# Altium schematic sheet Clocks.SchDoc: xcore.ai Multi Channel Audio
size 408 x 287 mm; DocumentNumber: 6; Revision: 1V1; SheetNumber: 6; SheetTotal: 8
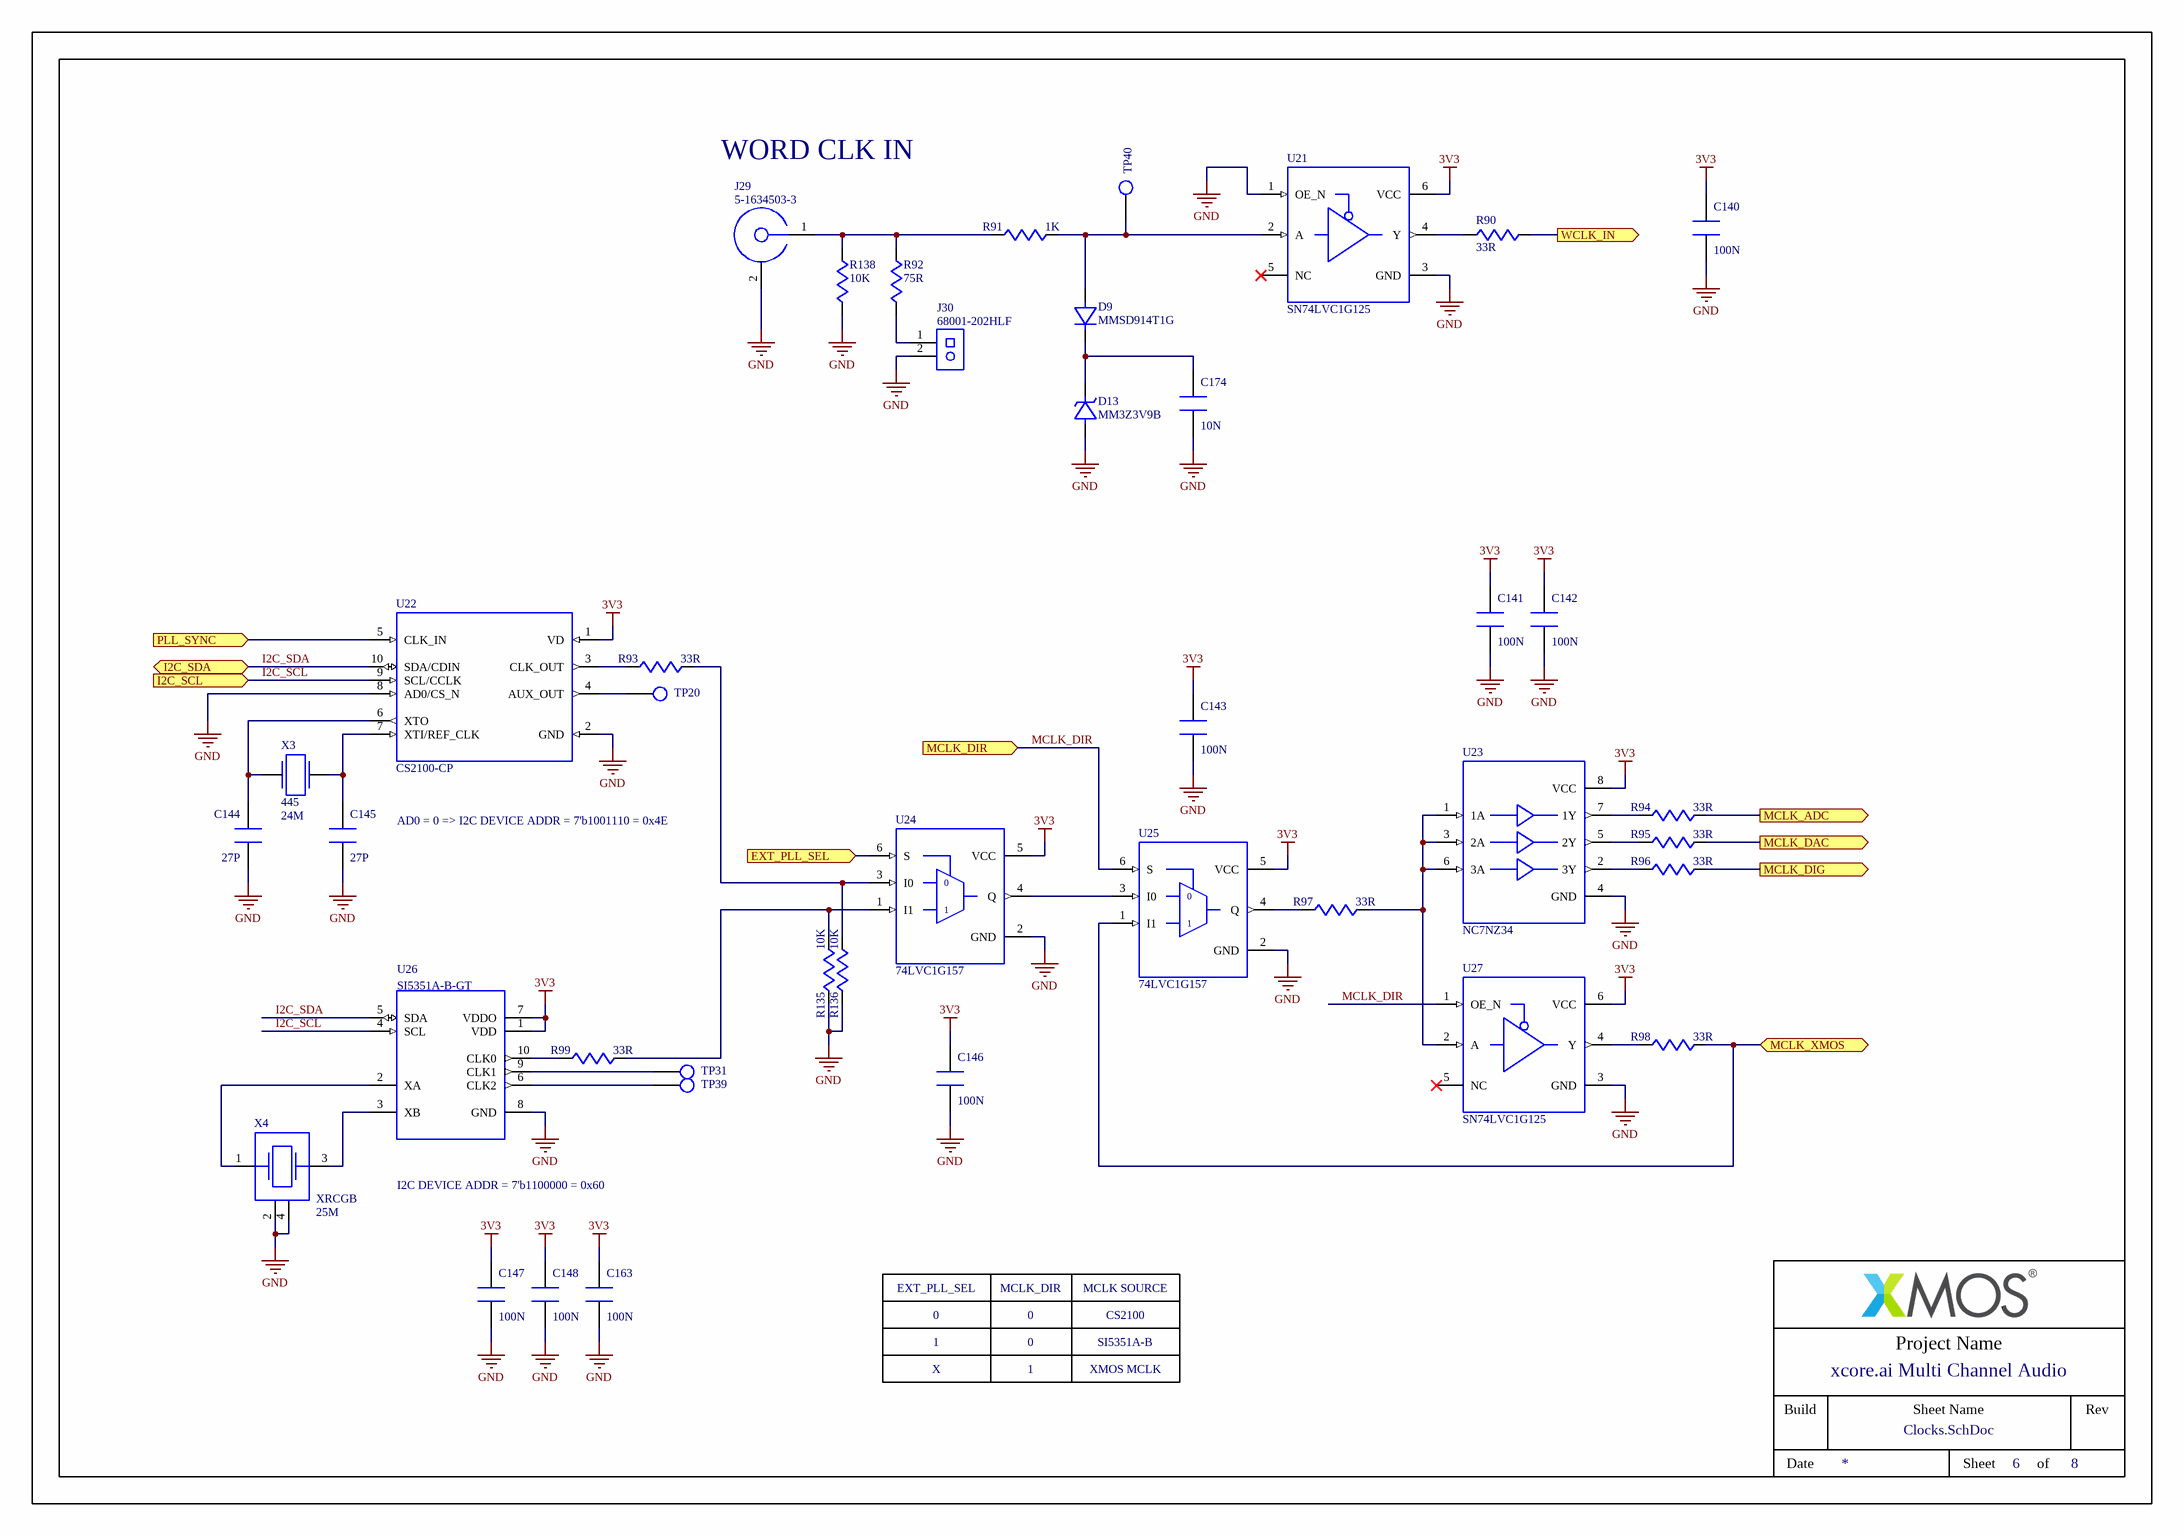
[diagram p0: Clocks.SchDoc]

## Parts
C140  100N  [CAPC1005X55N]
C141  100N  [CAPC1005X55N]
C142  100N  [CAPC1005X55N]
C143  100N  [CAPC1005X55N]
C144  27P  [CAPC1005X55N]
C145  27P  [CAPC1005X55N]
C146  100N  [CAPC1005X55N]
C147  100N  [CAPC1005X55N]
C148  100N  [CAPC1005X55N]
C163  100N  [CAPC1005X55N]
C174  10N  [CAPC1005X55N]
D9  MMSD914T1G  [SOD3716X135N]
D13  MM3Z3V9B  [SODFL2513X100N]
J29  5-1634503-3  [CON_TE_5_1634503]
J30  68001-202HLF  [HDR_FCI_68001_202]
R90  33R  [RESC1608X55N]
R91  1K  [RESC1608X55N]
R92  75R  [RESC3116X65N]
R93  33R  [RESC1608X55N]
R94  33R  [RESC1608X55N]
R95  33R  [RESC1608X55N]
R96  33R  [RESC1608X55N]
R97  33R  [RESC1608X55N]
R98  33R  [RESC1608X55N]
R99  33R  [RESC1608X55N]
R135  10K  [RESC1608X55N]
R136  10K  [RESC1608X55N]
R138  10K  [RESC1608X55N]
TP20  TESTPOINT  [TESTPOINT_THRU]  (value not drawn)  (no BOM)
TP31  TESTPOINT  [TESTPOINT_THRU]  (value not drawn)  (no BOM)
TP39  TESTPOINT  [TESTPOINT_THRU]  (value not drawn)  (no BOM)
TP40  TESTPOINT  [TESTPOINT_SMD_1MM]  (value not drawn)  (no BOM)
U21  SN74LVC1G125  [TI_R_PUSON_N6]
U22  CS2100-CP  [SOP50P490X110-10N]
U23  NC7NZ34  [SOP50P310X100-8N]
U24  74LVC1G157  [SOT95P280X145-6N]
U25  74LVC1G157  [SOT95P280X145-6N]
U26  SI5351A-B-GT  [SOP50P490X110-10N]
U27  SN74LVC1G125  [TI_R_PUSON_N6]
X3  445  FREQUENCY: 24M  [XTAL_CTS_445]
X4  XRCGB  FREQUENCY: 25M  [OSCCC200X160X70N]

## Ports
EXT_PLL_SEL (in), I2C_SCL (in), I2C_SDA (bidir), MCLK_ADC (out), MCLK_DAC (out), MCLK_DIG (out), MCLK_DIR (in), MCLK_XMOS (bidir), PLL_SYNC (in), WCLK_IN (out)

## Nets
3V3: C140.1 C141.1 C142.1 C143.1 C146.1 C147.1 C148.1 C163.1 U21.6(VCC) U22.1(VD) U23.8(VCC) U24.5(VCC) U25.5(VCC) U26.1(VDD) U26.7(VDDO) U27.6(VCC)
GND: C140.2 C141.2 C142.2 C143.2 C144.2 C145.2 C146.2 C147.2 C148.2 C163.2 C174.2 D13.2(A) J29.2 J30.2 R135.1 R136.1 R138.1 U21.1(OE_N) U21.3(GND) U22.2(GND) U22.8(AD0/CS_N) U23.4(GND) U24.2(GND) U25.2(GND) U26.8(GND) U27.3(GND) X4.2(CASE_2) X4.4(CASE_4)
EXT_PLL_SEL: U24.6(S) ; port EXT_PLL_SEL
I2C_SCL: U22.9(SCL/CCLK) U26.4(SCL) ; port I2C_SCL
I2C_SDA: U22.10(SDA/CDIN) U26.5(SDA) ; port I2C_SDA
MCLK_ADC: R94.2 ; port MCLK_ADC
MCLK_DAC: R95.2 ; port MCLK_DAC
MCLK_DIG: R96.2 ; port MCLK_DIG
MCLK_DIR: U25.6(S) U27.1(OE_N) ; port MCLK_DIR
MCLK_XMOS: R98.2 U25.1(I1) ; port MCLK_XMOS
PLL_SYNC: U22.5(CLK_IN) ; port PLL_SYNC
WCLK_IN: R90.2 ; port WCLK_IN
NetC144_1: C144.1 U22.6(XTO) X3.1(A)
NetC145_1: C145.1 U22.7(XTI/REF_CLK) X3.2(B)
NetC174_1: C174.1 D9.1(K) D13.1(K)
NetD9_2: D9.2(A) R91.2 TP40.1 U21.2(A)
NetJ29_1: J29.1 R91.1 R92.2 R138.2
NetJ30_1: J30.1 R92.1
NetR90_1: R90.1 U21.4(Y)
NetR93_1: R93.1 U22.3(CLK_OUT)
NetR93_2: R93.2 R136.2 U24.3(I0)
NetR94_1: R94.1 U23.7(1Y)
NetR95_1: R95.1 U23.5(2Y)
NetR96_1: R96.1 U23.2(3Y)
NetR97_1: R97.1 U25.4(Q)
NetR97_2: R97.2 U23.1(1A) U23.3(2A) U23.6(3A) U27.2(A)
NetR98_1: R98.1 U27.4(Y)
NetR99_1: R99.1 U26.10(CLK0)
NetR99_2: R99.2 R135.2 U24.1(I1)
NetTP20_1: TP20.1 U22.4(AUX_OUT)
NetTP31_1: TP31.1 U26.9(CLK1)
NetTP39_1: TP39.1 U26.6(CLK2)
NetU24_4: U24.4(Q) U25.3(I0)
NetU26_2: U26.2(XA) X4.1(A)
NetU26_3: U26.3(XB) X4.3(B)

Not connected (* = marked no-connect by the designer): U21 5(NC)*; U27 5(NC)*

## Notes on the sheet
- WORD CLK IN
- AD0 = 0 => I2C DEVICE ADDR = 7'b1001110 = 0x4E
- I2C DEVICE ADDR = 7'b1100000 = 0x60
- EXT_PLL_SEL
- MCLK_DIR
- MCLK SOURCE
- 0
- 1
- SI5351A-B
- CS2100
- X
- XMOS MCLK
- Project Name
- Build
- Sheet Name
- Rev
- Date
- Sheet
- of
- (in symbol GEN-11-0050) 0

## Library data of the parts
C140-C143 C146-C148 C163 = STD-06-0048: CHIP CAPACITOR, CERAMIC, 100NF, 16V, 10%, X7R, 0402; Manufacturer: Yageo; Manufacturer Part Number: CC0402KRX7R7BB104; Approx Volume Cost ($): 0.003; VALUE: 100N; Part Number: STD-06-0048; Dielectric: X7R; Rated Voltage: 16V; Tolerance: 10%; Web Search Link: http://www.google.com/search?q=CC0402KRX7R7BB104
C144 C145 = STD-06-0018: CHIP CAPACITOR, CERAMIC, 27PF, 50V, 5%, NP0, 0402; Manufacturer: Yageo; Manufacturer Part Number: CC0402JRNPO9BN270; Approx Volume Cost ($): 0.003; VALUE: 27P; Part Number: STD-06-0018; Dielectric: NP0; Rated Voltage: 50V; Tolerance: 5%; Web Search Link: http://www.google.com/search?q=CC0402JRNPO9BN270
C174 = STD-06-0042: CHIP CAPACITOR, CERAMIC, 10NF, 50V, 10%, X7R, 0402; Manufacturer: Yageo; Manufacturer Part Number: CC0402KRX7R9BB103; Approx Volume Cost ($): 0.002; VALUE: 10N; Part Number: STD-06-0042; Dielectric: X7R; Rated Voltage: 50V; Tolerance: 10%; Web Search Link: http://www.google.com/search?q=CC0402KRX7R9BB103
D9 = GEN-16-0055: Diode, 100V, 0.2A, SOD123; Manufacturer: ON Semiconductor; Approx Volume Cost ($): 0.04; VALUE: MMSD914T1G; Part Number: GEN-16-0055; Manufacturer Part Number: MMSD914T1G; Web Search Link: http://www.google.com/search?q=MMSD914T1G
D13 = GEN-16-0053: Zener Diode, 3.9V, 2%, 0.2W, SOD-323F; Manufacturer: ON Semiconductor; Approx Volume Cost ($): 0.03; VALUE: MM3Z3V9B; Part Number: GEN-16-0053; Manufacturer Part Number: MM3Z3V9B; Web Search Link: http://www.google.com/search?q=MM3Z3V9B
J29 = GEN-01-0127: BNC Jack, Board Mount, Vertical, 75 ohm, w/Mounting Posts; Manufacturer: TE Connectivity; Approx Volume Cost ($): 1.4; VALUE: 5-1634503-3; Part Number: GEN-01-0127; Manufacturer Part Number: 5-1634503-3; Web Search Link: http://www.google.com/search?q=5-1634503-3
J30 = GEN-01-0011: Pin Header, Male, Vertical, Through Hole, 2 Way, 1x2, 0.1 Inch Pitch; Manufacturer: FCI; Approx Volume Cost ($): 0.08; VALUE: 68001-202HLF; Part Number: GEN-01-0011; Manufacturer Part Number: 68001-202HLF; Web Search Link: http://www.google.com/search?q=68001-202HLF
R90 R93-R99 = STD-02-0026: CHIP RESISTOR, 33 OHM, 0.1W, 1%, 0603; Manufacturer: Yageo; Manufacturer Part Number: RC0603FR-0733RL; Max Voltage: 50V; Max Power: 100mW; Temperature Coefficient: ±100ppm/°C; Approx Volume Cost ($): 0.002; VALUE: 33R; Part Number: STD-02-0026; Tolerance: 1%; Web Search Link: http://www.google.com/search?q=RC0603FR-0733RL
R91 = STD-02-0062: CHIP RESISTOR, 1.0K OHM, 0.1W, 1%, 0603; Manufacturer: Yageo; Manufacturer Part Number: RC0603FR-071KL; Max Voltage: 50V; Max Power: 100mW; Temperature Coefficient: ±100ppm/°C; Approx Volume Cost ($): 0.002; VALUE: 1K; Part Number: STD-02-0062; Tolerance: 1%; Web Search Link: http://www.google.com/search?q=RC0603FR-071KL
R92 = STD-05-0035: CHIP RESISTOR, 75 OHM, 0.25W, 1%, 1206; Manufacturer: Yageo; Manufacturer Part Number: RC1206FR-0775RL; Max Voltage: 200V; Max Power: 250mW; Temperature Coefficient: ±100ppm/°C; Approx Volume Cost ($): 0.004; VALUE: 75R; Part Number: STD-05-0035; Tolerance: 1%; Web Search Link: http://www.google.com/search?q=RC1206FR-0775RL
R135 R136 R138 = STD-02-0086: CHIP RESISTOR, 10K OHM, 0.1W, 1%, 0603; Manufacturer: Yageo; Manufacturer Part Number: RC0603FR-0710KL; Max Voltage: 50V; Max Power: 100mW; Temperature Coefficient: ±100ppm/°C; Approx Volume Cost ($): 0.002; VALUE: 10K; Part Number: STD-02-0086; Tolerance: 1%; Web Search Link: http://www.google.com/search?q=RC0603FR-0710KL
TP20 TP31 TP39 = GEN-24-0002: Testpoint, Through Hole; Manufacturer: NA; VALUE: TESTPOINT; Part Number: GEN-24-0002; Manufacturer Part Number: NA; Approx Volume Cost ($): NA
TP40 = GEN-24-0003: Testpoint, SMD, 1mm; Manufacturer: NA; VALUE: TESTPOINT; Part Number: GEN-24-0003; Manufacturer Part Number: NA; Approx Volume Cost ($): NA
U21 U27 = GEN-11-0049: Single Buffer with 3-State Output, LVC Series, SON6; Manufacturer: Texas Instruments; Manufacturer Part Number: SN74LVC1G125DRYR; Approx Volume Cost ($): 0.14; VALUE: SN74LVC1G125; Part Number: GEN-11-0049; Web Search Link: http://www.google.com/search?q=SN74LVC1G125DRYR
U22 = GEN-07-0007: Fractional-N Clock Multiplier, I2C/SPI Control, MSOP10; Manufacturer: Cirrus Logic; Manufacturer Part Number: CS2100CP-CZZ; Approx Volume Cost ($): 3.23; VALUE: CS2100-CP; Part Number: GEN-07-0007; Web Search Link: http://www.google.com/search?q=CS2100CP-CZZ
U23 = GEN-11-0025: Triple Logic Buffer, UHS Series, US8; Manufacturer: Fairchild; Manufacturer Part Number: NC7NZ34K8X; Approx Volume Cost ($): 0.17; VALUE: NC7NZ34; Part Number: GEN-11-0025; Web Search Link: http://www.google.com/search?q=NC7NZ34K8X
U24 U25 = GEN-11-0050: Two Input Non-Inverting Multiplexer, LVC Series, TSOP6; Manufacturer: Nexperia; Manufacturer Part Number: 74LVC1G157GV; Approx Volume Cost ($): 0.1; VALUE: 74LVC1G157; Part Number: GEN-11-0050; Web Search Link: http://www.google.com/search?q=74LVC1G157GV
U26 = GEN-07-0005: Clock Generator, I2C Programmable, XTAL Input, 3 Outputs, MSOP10; Manufacturer: Silicon Labs; Approx Volume Cost ($): 1.03; VALUE: SI5351A-B-GT; Part Number: GEN-07-0005; Manufacturer Part Number: SI5351A-B-GT; Web Search Link: http://www.google.com/search?q=SI5351A-B-GT
X3 = GEN-15-0041: Crystal, 24MHz, Freq Tol. ±30ppm, Freq Stab. ±30ppm, CL 18pF, Max ESR 40 Ohm, 5x3.2mm SMD; Manufacturer: CTS; Manufacturer Part Number: 445C33D24M00000; Approx Volume Cost ($): 0.33; VALUE: 445; Part Number: GEN-15-0041; Web Search Link: http://www.google.com/search?q=445C33D24M00000
X4 = GEN-15-0039: Crystal, 25MHz, Freq Tol. ±25ppm, Freq Stab. ±40ppm, CL 8pF, Max ESR 80 Ohm, 2.0x1.6mm SMD; Manufacturer: Murata; Manufacturer Part Number: XRCGB25M000FAM10R0; Approx Volume Cost ($): 0.27; VALUE: XRCGB; Part Number: GEN-15-0039; Web Search Link: http://www.google.com/search?q=XRCGB25M000FAM10R0